# Altium schematic sheet 1_Top_Sheet.SchDoc
size B
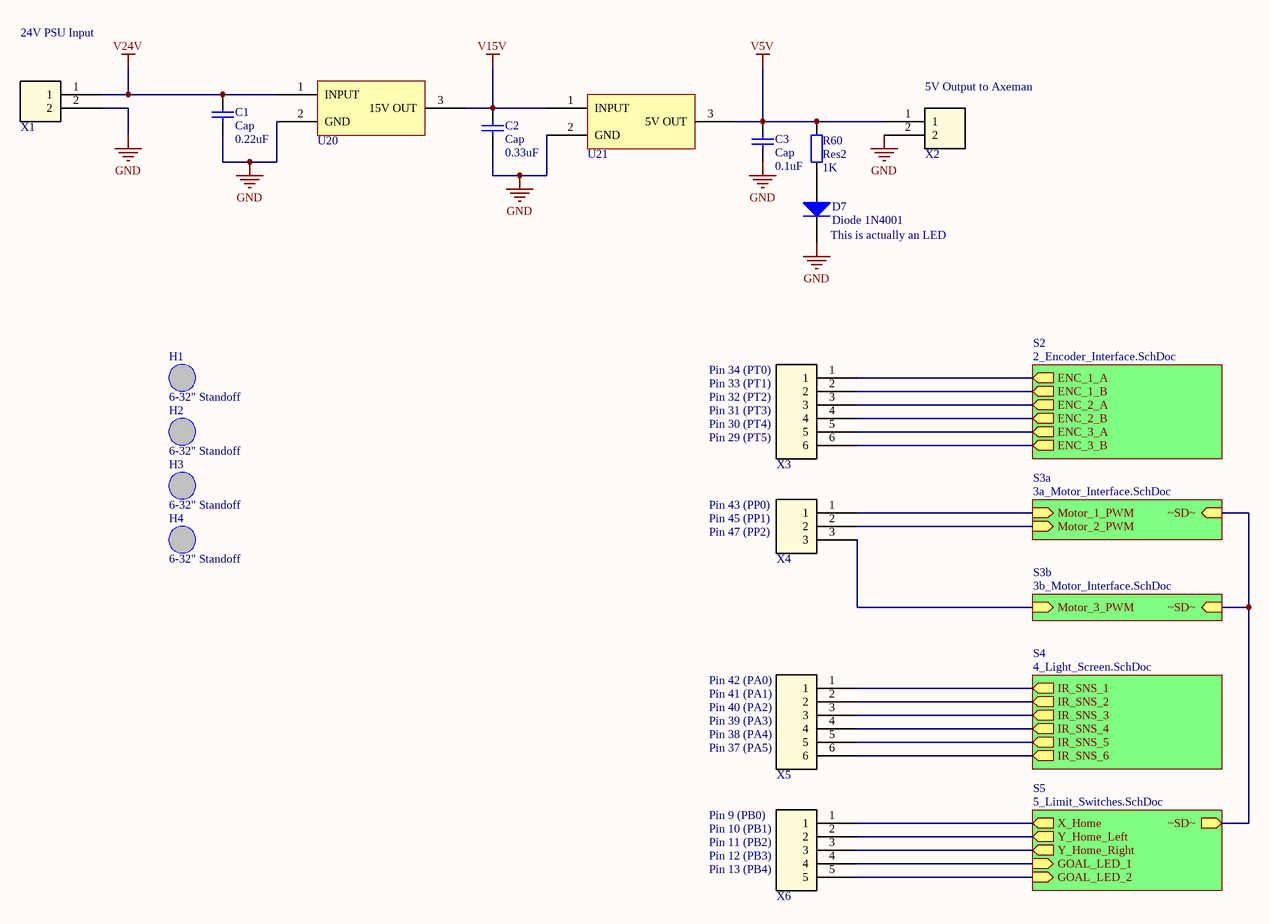
[diagram p0: 1_Top_Sheet.SchDoc]

## Parts
C1  Cap  value 0.22uF  [RAD-0.3]
C2  Cap  value 0.33uF  [RAD-0.3]
C3  Cap  value 0.1uF  [RAD-0.3]
D7  Diode 1N4001  [DO-41]
H1  6-32" Standoff  [6-32" Standoff]
H2  6-32" Standoff  [6-32" Standoff]
H3  6-32" Standoff  [6-32" Standoff]
H4  6-32" Standoff  [6-32" Standoff]
R60  Res2  value 1K  [AXIAL-0.4]
U20  IC REG LINEAR 15V 1A TO220-3  [TO-220]  (value not drawn)
U21  IC REG LINEAR 5V 1.5A TO220-3  [TO-220]  (value not drawn)
X1  TERM BLOCK HDR 2POS VERT 7.62MM  [PCV 4-2]  (value not drawn)
X2  TERM BLOCK HDR 2POS VERT 3.5MM  [WR-TBL-3211 2]  (value not drawn)
X3  TERM BLOCK HDR 6POS VERT 3.5MM  [WR-TBL-3211 6]  (value not drawn)
X4  TERM BLOCK HDR 3POS VERT 3.5MM  [WR-TBL-3211 3]  (value not drawn)
X5  TERM BLOCK HDR 6POS VERT 3.5MM  [WR-TBL-3211 6]  (value not drawn)
X6  TERM BLOCK HDR 5POS VERT 3.5MM  [WR-TBL-3211 5]  (value not drawn)

## Sub-sheets
S2 = 2_Encoder_Interface.SchDoc: ENC_1_A (out), ENC_1_B (out), ENC_2_A (out), ENC_2_B (out), ENC_3_A (out), ENC_3_B (out)
S3a = 3a_Motor_Interface.SchDoc: Motor_1_PWM (in), Motor_2_PWM (in), ~SD~ (in)
S3b = 3b_Motor_Interface.SchDoc: Motor_3_PWM (in), ~SD~ (in)
S4 = 4_Light_Screen.SchDoc: IR_SNS_1 (out), IR_SNS_2 (out), IR_SNS_3 (out), IR_SNS_4 (out), IR_SNS_5 (out), IR_SNS_6 (out)
S5 = 5_Limit_Switches.SchDoc: X_Home (out), Y_Home_Left (out), Y_Home_Right (out), ~SD~ (out), GOAL_LED_1 (in), GOAL_LED_2 (in)

## Nets
GND: C1.1 C2.1 C3.1 D7.2(K) U20.2(GND) U21.2(GND) X1.2 X2.2
V5V: C3.2 R60.2 U21.3(5V_OUT) X2.1
V15V: C2.2 U20.3(15V_OUT) U21.1(INPUT)
V24V: C1.2 U20.1(INPUT) X1.1
NetD7_1: D7.1(A) R60.1
NetX3_1: X3.1 ; sheet S2/ENC_1_A
NetX3_2: X3.2 ; sheet S2/ENC_1_B
NetX3_3: X3.3 ; sheet S2/ENC_2_A
NetX3_4: X3.4 ; sheet S2/ENC_2_B
NetX3_5: X3.5 ; sheet S2/ENC_3_A
NetX3_6: X3.6 ; sheet S2/ENC_3_B
NetX4_1: X4.1 ; sheet S3a/Motor_1_PWM
NetX4_2: X4.2 ; sheet S3a/Motor_2_PWM
NetX4_3: X4.3 ; sheet S3b/Motor_3_PWM
NetX5_1: X5.1 ; sheet S4/IR_SNS_1
NetX5_2: X5.2 ; sheet S4/IR_SNS_2
NetX5_3: X5.3 ; sheet S4/IR_SNS_3
NetX5_4: X5.4 ; sheet S4/IR_SNS_4
NetX5_5: X5.5 ; sheet S4/IR_SNS_5
NetX5_6: X5.6 ; sheet S4/IR_SNS_6
NetX6_1: X6.1 ; sheet S5/X_Home
NetX6_2: X6.2 ; sheet S5/Y_Home_Left
NetX6_3: X6.3 ; sheet S5/Y_Home_Right
NetX6_4: X6.4 ; sheet S5/GOAL_LED_1
NetX6_5: X6.5 ; sheet S5/GOAL_LED_2
(unnamed): sheet S3a/~SD~, sheet S3b/~SD~, sheet S5/~SD~

## Notes on the sheet
- 24V PSU Input
- (near X2) 5V Output to Axeman
- (near D7) This is actually an LED
- (near X3) Pin 34 (PT0)
- (near X3) Pin 33 (PT1)
- (near X3) Pin 32 (PT2)
- (near X3) Pin 31 (PT3)
- (near X3) Pin 30 (PT4)
- (near X3) Pin 29 (PT5)
- (near X4) Pin 43 (PP0)
- (near X4) Pin 45 (PP1)
- (near X4) Pin 47 (PP2)
- (near X5) Pin 42 (PA0)
- (near X5) Pin 41 (PA1)
- (near X5) Pin 40 (PA2)
- (near X5) Pin 39 (PA3)
- (near X5) Pin 38 (PA4)
- (near X5) Pin 37 (PA5)
- (near X6) Pin 9 (PB0)
- (near X6) Pin 10 (PB1)
- (near X6) Pin 11 (PB2)
- (near X6) Pin 12 (PB3)
- (near X6) Pin 13 (PB4)
- ESE
- is the sole property of ESE. Any reproduction
- The Information Contained in this drawing
- Schematic P/N and Name
- Sheet Name
- 299 Doon Valley Drive
- Kitchener, ON N2G 4M4
- Canada
- Approved
- in part or in whole without the written
- permission of ESE is strictly prohibited.
- APPROVALS
- DATE
- Size
- Scale
- B
- NTS
- Bare PCB P/N
- Date
- Sheet
- Rev.
- Checked
- Engineer
- of

## Library data of the parts
C1-C3 = Cap: Capacitor; Published: 8-Jun-2000; LatestRevisionDate: 17-Jul-2002; LatestRevisionNote: Re-released for DXP Platform.; PackageReference: RAD-0.3; Publisher: Altium Limited; PackageDescription: Radial Cap, Thru-Hole; 2 Leads; 0.3 in Pin Spacing
D7 = Diode 1N4001: 1 Amp General Purpose Rectifier; Published: 8-Jun-2000; LatestRevisionDate: 17-Jul-2002; LatestRevisionNote: Re-released for DXP Platform.; DatasheetVersion: 1998; PackageVersion: Aug-1999; PackageReference: DO-41; Publisher: Altium Limited; PackageDescription: Diode, Axial; Body 5.2 x 2.7 mm (LxDia. max), Lead Dia. 0.86 mm (max); Code_JEDEC: DO-204-AL; ComponentLink1Description: Manufacturer Link; ComponentLink1URL: http://www.fairchildsemi.com/; ComponentLink2Description: Datasheet; ComponentLink2URL: http://www.fairchildsemi.com/ds/1N%2F1N4001.pdf
H1-H4 = 6-32" Standoff: Mounting hole for 6-32" Standoff
R60 = Res2: Resistor; Published: 8-Jun-2000; LatestRevisionDate: 17-Jul-2002; LatestRevisionNote: Re-released for DXP Platform.; PackageReference: AXIAL-0.4; Publisher: Altium Limited; PackageDescription: Axial Device, Thru-Hole; 2 Leads; 0.4 in Pin Spacing
U20 = IC REG LINEAR 15V 1A TO220-3: Manufacturer_Part_Number: LM340T-15/NOPB; Manufacturer: Texas Instruments; Digi-Key_Part_Number: LM340T-15/NOPB-ND
U21 = IC REG LINEAR 5V 1.5A TO220-3: Manufacturer_Part_Number: UA7805CKCS; Manufacturer: Texas Instruments; Digi-Key_Part_Number: 296-13996-5-ND
X1 = TERM BLOCK HDR 2POS VERT 7.62MM: Manufacturer_Part_Number: 1804687; Manufacturer: Phoenix Contact; DigiKey_Part_Number: 277-1469-ND
X2 = TERM BLOCK HDR 2POS VERT 3.5MM: Manufacturer_Part_Number: 691321100002; Manufacturer: Wurth Electronics Inc; DigiKey_Part_Number: 732-2763-ND
X3 X5 = TERM BLOCK HDR 6POS VERT 3.5MM: Manufacturer_Part_Number: 691321100006; Manufacturer: Wurth Electronics Inc; DigiKey_Part_Number: 732-2767-ND
X4 = TERM BLOCK HDR 3POS VERT 3.5MM: Manufacturer_Part_Number: 691321100003; Manufacturer: Wurth Electronics Inc; DigiKey_Part_Number: 732-2764-ND
X6 = TERM BLOCK HDR 5POS VERT 3.5MM: Manufacturer_Part_Number: 691321100005; Manufacturer: Wurth Electronics Inc; DigiKey_Part_Number: 732-2766-ND